# Altium schematic sheet Sheet4_Communications.SchDoc
size A4; SheetNumber: 4; SheetTotal: 5
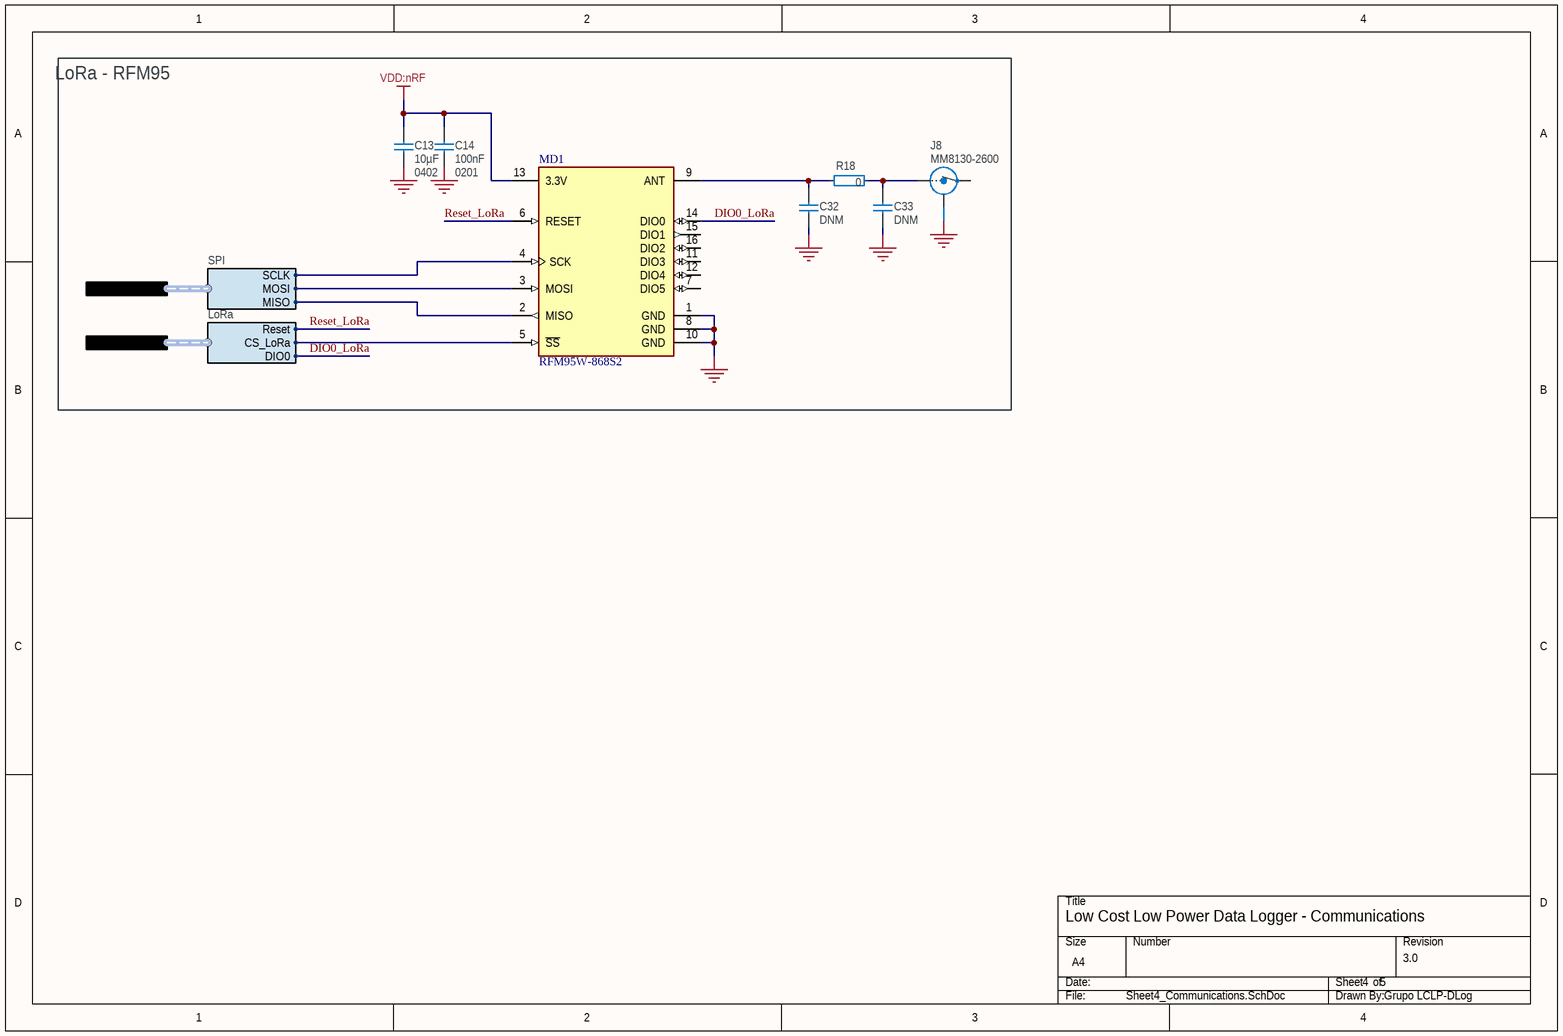
[diagram p0: Sheet4_Communications.SchDoc]

## Parts
C13  10µF  Footprint Doc: 0402  [CAPC1005X04L]
C14  100nF  Footprint Doc: 0201  [CAPC0603X03L_C]
C32  DNM  [CAPC1005X04L_DNM]
C33  DNM  [CAPC1005X04L_DNM]
J8  MM8130-2600  [COAXIAL-SWF]
MD1  RFM95W-868S2  [FP-RFM95W-868S2-MFG]
R18  0  [RESC1005X04L]

## Blocks framed on the sheet
LoRa - RFM95: C13 C14 C32 C33 J8 MD1 R18

## Ports
LoRa_Pins (harness LoRa, see Sheet1_Connections[3C], Sheet2_nRF54L15[4A]), SPI22 (harness SPI, see Sheet1_Connections[3B], Sheet2_nRF54L15[4A], Sheet5_Misc[2A])

## Harnesses
SPI: MISO, MOSI, SCLK
LoRa: DIO0, Reset, CS_LoRa

## Nets
GND: C13.1 C14.2 C32.1 C33.1 J8.2(Shield) MD1.1(GND) MD1.8(GND) MD1.10(GND)
VDD:nRF: C13.2 C14.1 MD1.13(3.3V)
DIO0_LoRa: MD1.14(DIO0) ; port LoRa_Pins.DIO0
Reset_LoRa: MD1.6(RESET) ; port LoRa_Pins.Reset
NetC32_2: C32.2 MD1.9(ANT) R18.2
NetC33_2: C33.2 J8.1(IN) R18.1
NetMD1_2: MD1.2(MISO) ; port SPI22.MISO
NetMD1_3: MD1.3(MOSI) ; port SPI22.MOSI
NetMD1_4: MD1.4(SCK) ; port SPI22.SCLK
NetMD1_5: MD1.5(~{SS}) ; port LoRa_Pins.CS_LoRa

Not connected (* = marked no-connect by the designer): J8 3(OUT); MD1 7(DIO5) 11(DIO3) 12(DIO4) 15(DIO1) 16(DIO2)

## Notes on the sheet
- Low Cost Low Power Data Logger - Communications
- 4
- 5
- 3.0
- Grupo LCLP-DLog

## Library data of the parts
C13 = C0402-10µF-6.3V-X6S: Capacitor, X6S, ±20%, 6.3V; Manufacturer: N.A.; Part number NEMS: 100200478; Component Status: Active; Pad Count: 2; Part Number: C0402-10µF-6.3V-X6S; PartId: 100200478; Component Class: Capacitors; Author: getr; Manufacturer Part Number: N.A.; ComponentLink1URL: N.A.; ComponentLink1Description: Datasheet; ComponentLink2URL: N.A.; ComponentLink2Description: Supplier link; HelpURL: N.A.; LatestRevisionDate: 2021-06-25; Published: 2021-06-25; Value: 10µF; Note: 6.3V; Supplier 1: N.A.; Supplier Part Number 1: N.A.; Supplier 2: N.A.; Supplier Part Number 2: N.A.; Artikkelnr Noca: N.A.; Part number IPS: N.A.; Part number Norautron: N.A.
C14 = C0201-100n-10V-X7R: Capacitor, X7R, ±10%; Manufacturer: N.A.; Part number NEMS: 100200469; Note: 10V; Pad Count: 2; Component Status: Active; Part Number: C0201-100n-10V-X7R; Manufacturer Part Number: N.A.; LatestRevisionDate: 2021-04-12; Published: 2021-04-12; Value: 100nF; Artikkelnr Noca: N.A.; Part number IPS: N.A.; ComponentLink1URL: N.A.; ComponentLink1Description: Datasheet; ComponentLink2URL: N.A.; ComponentLink2Description: Supplier link; HelpURL: N.A.; Supplier 1: N.A.; Supplier Part Number 1: N.A.; Supplier 2: N.A.; Supplier Part Number 2: N.A.; Component Class: Capacitors; Author: getr; Part number Norautron: N.A.; PartId: 100200469
C32 C33 = C0402-2µ2-10V: Capacitor, X5R, ±10%; Manufacturer: N.A.; Part number NEMS: 100200376; Component Status: Active; Pad Count: 2; Value: 2.2µF; Note: 10V; Part Number: C0402-2µ2-10V; PartId: 100200376; Component Class: Capacitors; Author: rsk; Manufacturer Part Number: N.A.; ComponentLink1URL: N.A.; ComponentLink1Description: Datasheet; ComponentLink2URL: N.A.; ComponentLink2Description: Supplier link; HelpURL: N.A.; LatestRevisionDate: 2020-10-13; Published: 2016-08-22; Footprint Doc: 0402; Supplier 1: Digi-Key; Supplier Part Number 1: 490-10451-1-ND; Supplier 2: N.A.; Supplier Part Number 2: N.A.; Artikkelnr Noca: N.A.; Part number IPS: N.A.; Part number Norautron: N.A.
J8 = MM8130-2600: Coaxial Connector with Switch; Manufacturer: Murata; Part number IPS: 00000009955; Part number Norautron: 26030338; Part number NEMS: 100500400; Component Status: Active; Pad Count: 3; Note: N.A.; Artikkelnr Noca: 55029011; Part Number: MM8130-2600; PartId: 100500400; Component Class: Connectors; Author: rsk; Manufacturer Part Number: MM8130-2600; ComponentLink1URL: N.A.; ComponentLink1Description: Datasheet; ComponentLink2URL: N.A.; ComponentLink2Description: Supplier link; HelpURL: http://www.murata.com/products/catalog/pdf/o33e.pdf; LatestRevisionDate: 2014-04-24; Published: 2014-04-24; Footprint Doc: COAXIAL-SWF; Value: MM8130-2600; Supplier 1: Digi-Key; Supplier Part Number 1: 490-4981-1-ND; Supplier 2: Mouser; Supplier Part Number 2: 81-MM8130-2600RA2; System: Connector
MD1 = CMP-00000-1: RFM95W LoRA Transceiver Module 868MHz; Sensitivity (dBm): -123dBm; Min Supply Voltage: 1.8V; Max Junction Temperature (Tj): 125°C; Number of GPIO: 6; Interface: SPI; Data Rate: 300kbps; Nominal Supply Current: 5.8mA; Max Supply Voltage: 3.7V; Current - Receiving: 13.8mA; Current - Transmitting: 120mA; Frequency: 868MHz; Case/Package: SMD/SMT; Height: 1.8mm; Min Operating Temperature: -20°C; Mounting Technology: Surface Mount; Clock Frequency: 868MHz; RoHS: Compliant; Max Operating Temperature: 70°C
R18 = R0201-1k0: Resistor, ±1%, 0.05W; Manufacturer: N.A.; Part number IPS: 00000005786; Part number NEMS: 100100043; Component Status: Active; Pad Count: 2; Value: 1k; Note: Chip Res 1%; Part Number: R0201-1k0; PartId: 100100043; Component Class: Resistors; Author: rsk; Manufacturer Part Number: N.A.; ComponentLink1URL: N.A.; ComponentLink1Description: Datasheet; ComponentLink2URL: N.A.; ComponentLink2Description: Supplier link; HelpURL: N.A.; LatestRevisionDate: 2014-11-13; Published: 2014-11-13; Supplier 1: N.A.; Supplier Part Number 1: N.A.; Supplier 2: N.A.; Supplier Part Number 2: N.A.; Artikkelnr Noca: N.A.; Part number Norautron: N.A.